# EAGLE design hm11 (EAGLE 7.2.0)
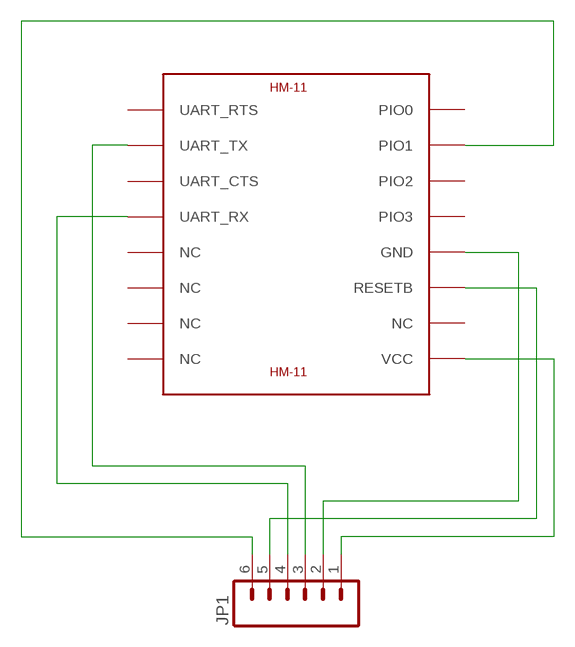
[diagram p0: schematic, sheet 1]

## Parts
JP1  M06SIP  [1X06]
U$1  HM-11  [HM-11]

## Nets
GND: JP1.2 U$1.GND
N$2: JP1.1 U$1.VCC
N$3: JP1.3 U$1.UART_TX
N$4: JP1.6 U$1.PIO1
N$5: JP1.4 U$1.UART_RX
N$6: JP1.5 U$1.RESETB
Unconnected: U$1.NC@5(NC) U$1.NC@6(NC) U$1.NC@7(NC) U$1.NC@8(NC) U$1.NC@10(NC) U$1.PIO0 U$1.PIO2 U$1.PIO3 U$1.UART_CTS U$1.UART_RTS

## Library data of the parts
JP1 = SparkFun-Connectors:M06: Header 6 Standard 6-pin 0.1" header. Use with straight break away headers (SKU : PRT-00116), right angle break away headers (PRT-00553), swiss pins (PRT-00743), machine pins (PRT-00117), and female headers (PRT-00115). Molex polarized connector foot print use with SKU : PRT-08094 with associated crimp pins and housings. NOTES ON THE VARIANTS LOCK and LOCK_LONGPADS... This footprint was designed to help hold the alignment of a through-hole component (i.e. 6-pin header) while soldering it into place. You may notice that each hole has been shifted either up or down by 0.005 of an inch from it's more standard position (which is a perfectly straight line). This slight alteration caused the pins (the squares in the middle) to touch the edges of the holes. Because they are alternating, it causes a "brace" to hold the component in place. 0.005 has proven to be the perfect amount of "off-center" position when using our standard breakaway headers. Although looks a little odd when you look at the bare footprint, once you have a header in there, the alteration is very hard to notice. Also,if you push a header all the way into place, it is covered up entirely on the bottom side. This idea of altering the position of holes to aid alignment will be further integrated into the Sparkfun Library for other footprints. It can help hold any component with 3 or more connection pins.
U$1 = hm-11:HM-11: JNHuaMao HM-11 Bluetooth 4.0 Transceiver based on TI CC2540/CC2541

## Board
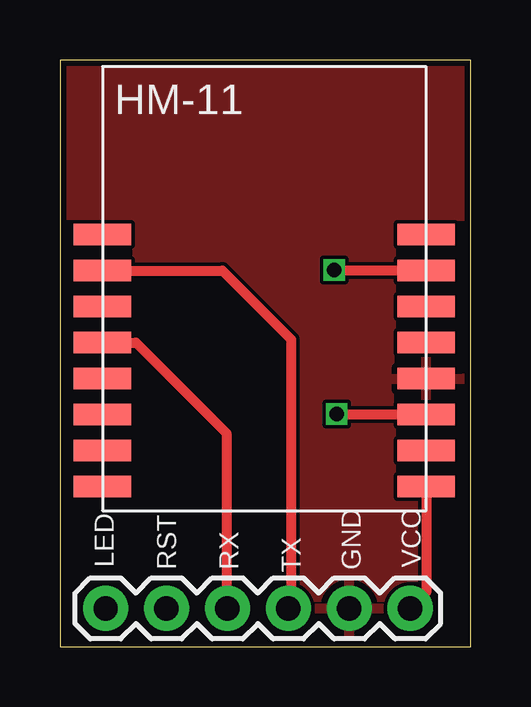
[diagram p1: board, top side]
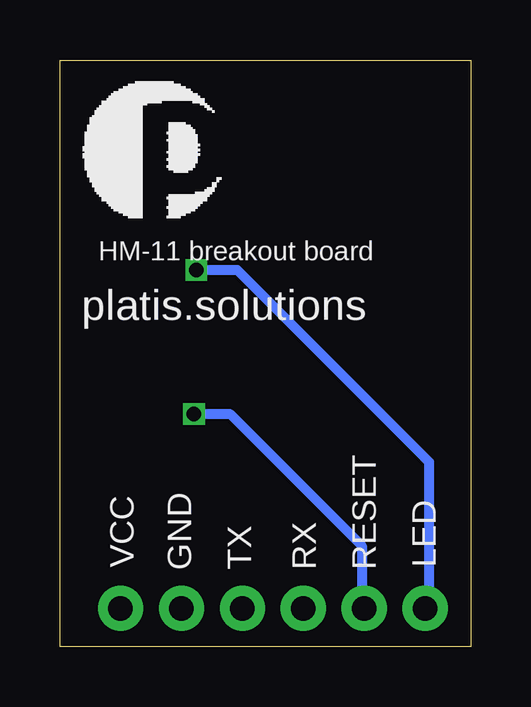
[diagram p2: board, bottom side, seen from below]

Size 17.13 x 24.44 mm. Coordinates in mm from the lower left corner, seen from the top.
Outline: 0,0 17.13,0 17.13,24.44 0,24.44 0,0
Copper layers (1*2*15*16): Top 0.035mm / dielectric 0.2mm / layer 2 0.0175mm / dielectric 1.1mm / layer 15 0.0175mm / dielectric 0.2mm / Bottom 0.035mm
Design rules "SeeedStudio_DRU_no_angle_20130527": minimum track width 6mil, minimum drill 12mil, track to track 6mil, track to pad 6mil, pad to pad 6mil, via to via 6mil, smd to smd 0mil, copper to edge 10mil, drill to drill 10mil, minimum pad ring 6mil, minimum via ring 6mil, stop-mask expansion 2mil, vias tented up to drill 25mil, thermal gap 10mil

### Footprints (pad centres in the part's own frame; a part is rotated, then mirrored left to right if it is on the bottom)
1X06 = drill 1.016 pad 1.88: 1 0,0; 2 2.54,0; 3 5.08,0; 4 7.62,0; 5 10.16,0; 6 12.7,0
HM-11 = smd 2.4 x 0.9: GND 6.5,0; NC@5 -7,0; NC@6 -7,-1.5; NC@7 -7,-3; NC@8 -7,-4.5; NC@10 6.5,-3; PIO0 6.5,6; PIO1 6.5,4.5; PIO2 6.5,3; PIO3 6.5,1.5; RESETB 6.5,-1.5; UART_CTS -7,3; UART_RTS -7,6; UART_RX -7,1.5; UART_TX -7,4.5; VCC 6.5,-4.5

### Placement (x,y rotation side)
JP1  14.6,1.59 180 top
U$1  8.78,11.16 0 top

### Tracks (layer width: path | path; a pad name or v marks a point on that pad's centre or on a via)
GND
  pour Top: 0.04,24.39 17.14,24.39 17.14,0.09 0.04,0.09
N$2
  Top 0.406: U$1.VCC 15.28,2.26 JP1.1
N$3
  Top 0.406: U$1.UART_TX 6.77,15.66 9.64,12.79 9.64,1.71 JP1.3
N$4  (via drill 0.6)
  Top 0.406: U$1.PIO1 11.47,15.66 v11.44,15.69
  Bottom 0.406: v11.44,15.69 9.74,15.69 1.74,7.69 1.74,1.75 JP1.6
N$5
  Top 0.406: U$1.UART_RX 3.17,12.66 6.94,8.89 6.94,1.63 JP1.4
N$6  (via drill 0.6)
  Top 0.406: U$1.RESETB 11.57,9.66 v11.54,9.69
  Bottom 0.406: v11.54,9.69 10.04,9.69 4.54,4.19 4.54,1.69 JP1.5

### Text on the board
tPlace: LED | RST | RX | TX | GND | VCC
bPlace: HM-11 breakout board | platis.solutions | LED | RESET | RX | TX | GND | VCC